# Altium schematic sheet POWER_DCDC_SOM.SchDoc: POWER DCDC SOM
size A3; Author: Silvio Navaretti; CompanyName: ARDUINO; DrawnBy: Silvio Navaretti; Engineer: Silvio Navaretti; Organization: ARDUINO; SheetNumber: 39; SheetTotal: 51; RevAuthor: Silvio Navaretti
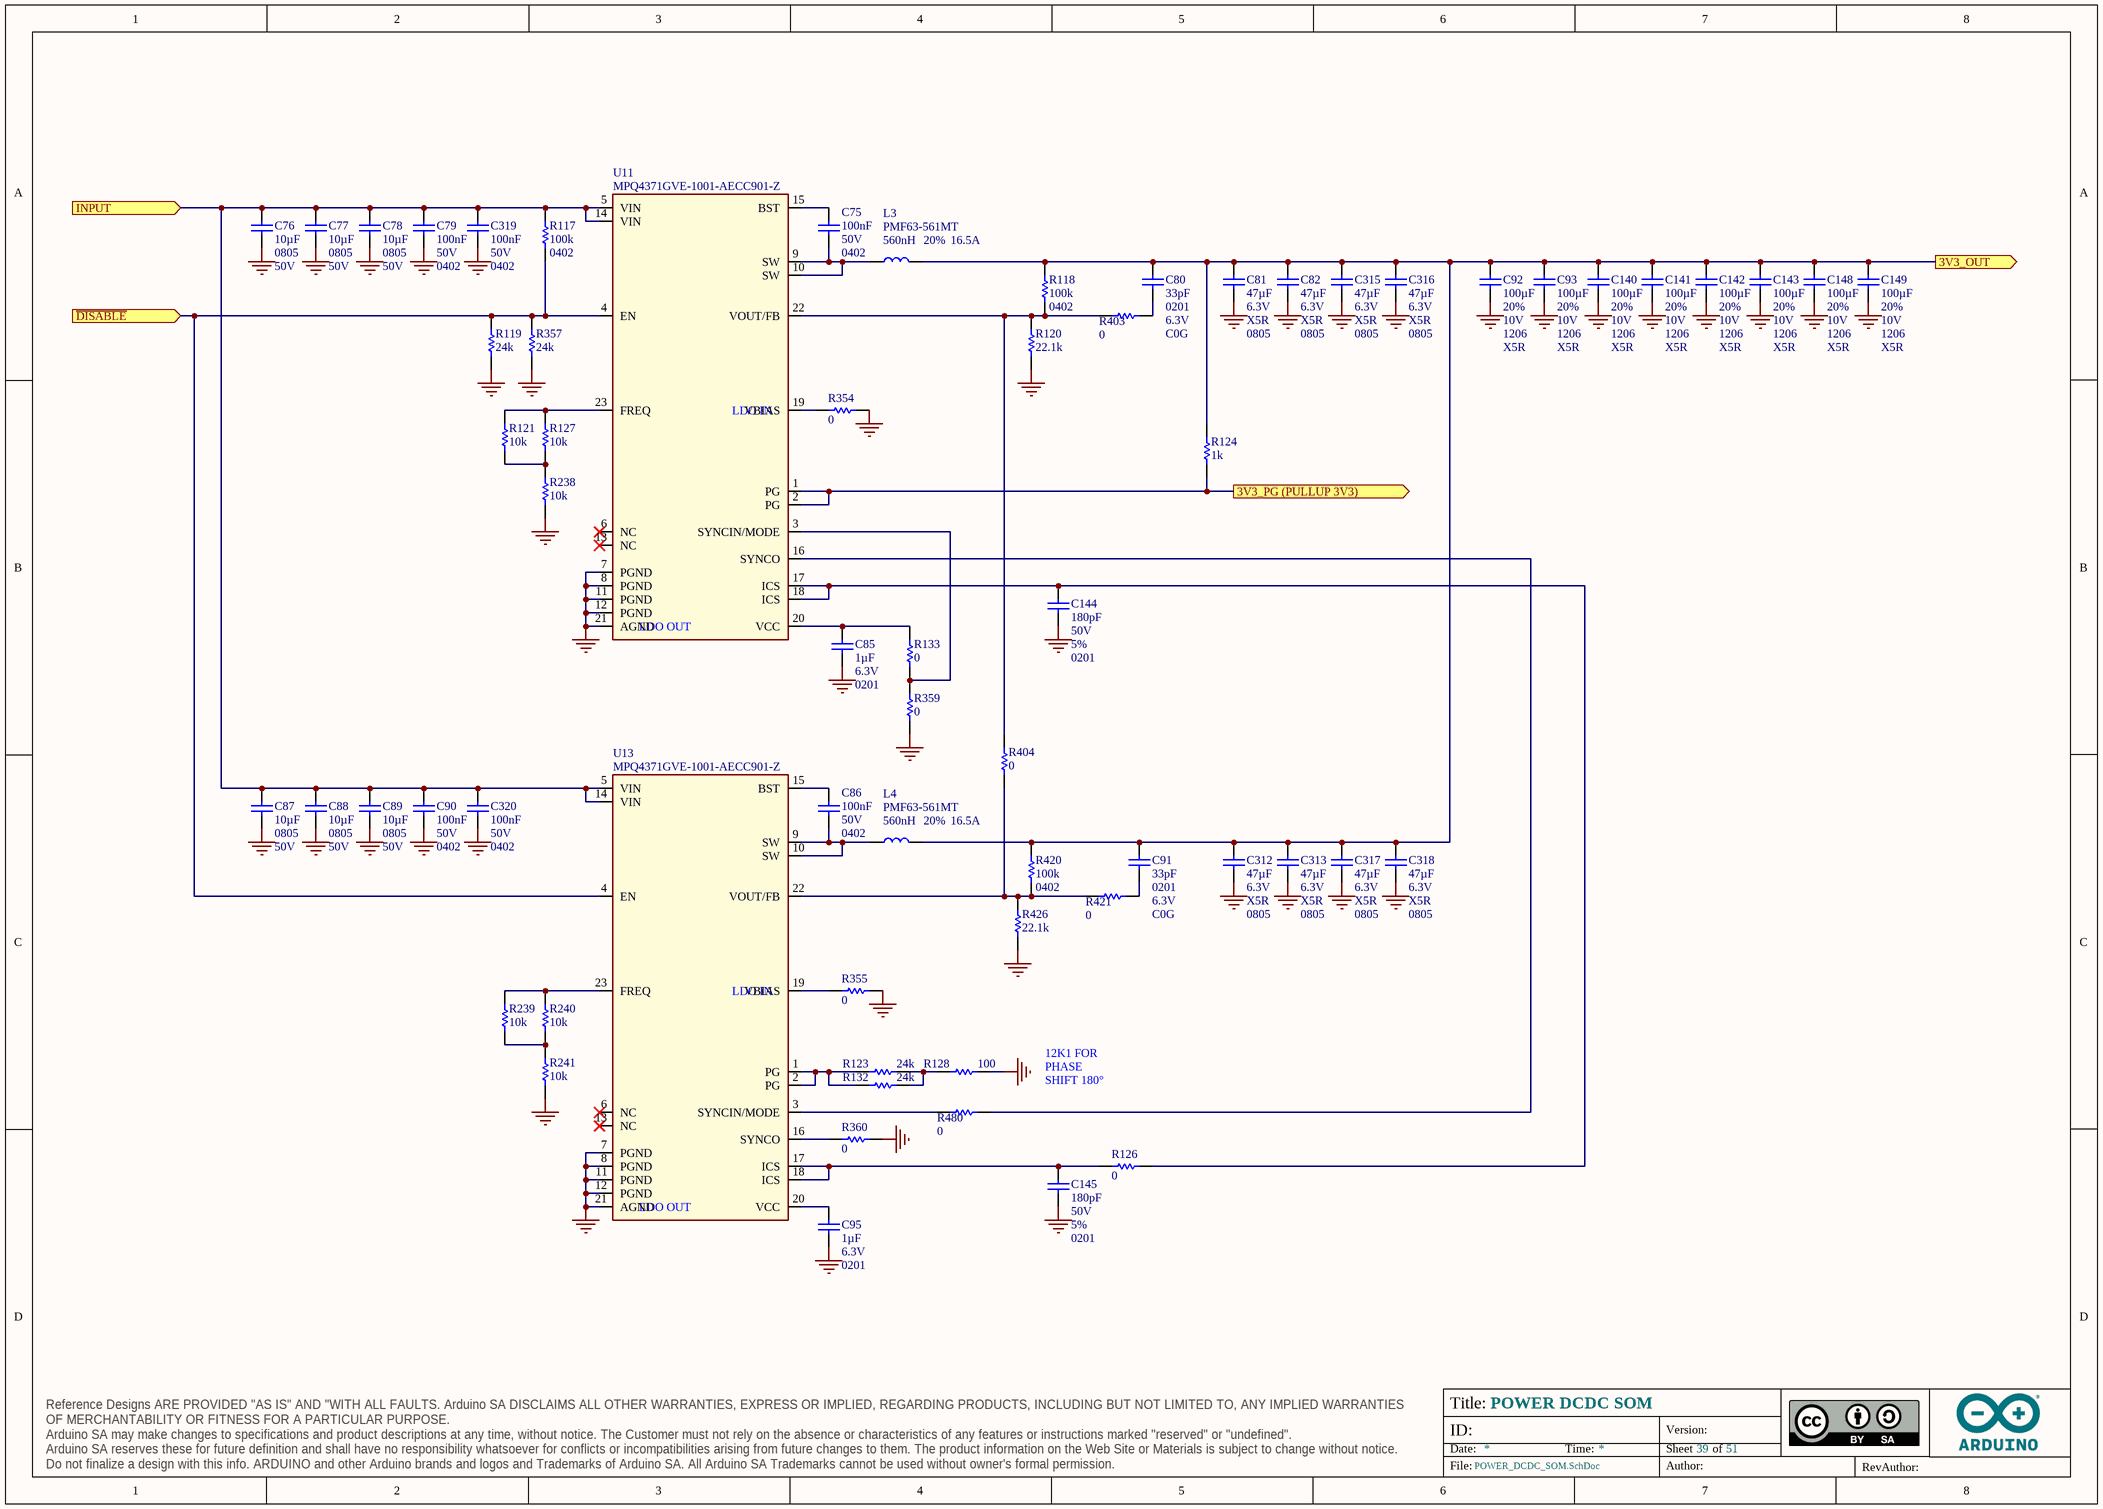
[diagram p0: POWER_DCDC_SOM.SchDoc]

## Parts
C75  value 100nF  Voltage: 50V  Case Code (Imperial): 0402  [CAP-0402]  (hidden comment: GRM155R61H104KE19D)
C76  value 10µF  Case Code (Imperial): 0805  Voltage: 50V  [CAP-0805]  (hidden comment: GRM21BR61H106ME43L)
C77  value 10µF  Case Code (Imperial): 0805  Voltage: 50V  [CAP-0805]  (hidden comment: GRM21BR61H106ME43L)
C78  value 10µF  Case Code (Imperial): 0805  Voltage: 50V  [CAP-0805]  (hidden comment: GRM21BR61H106ME43L)
C79  value 100nF  Voltage: 50V  Case Code (Imperial): 0402  [CAP-0402]  (hidden comment: GRM155R61H104KE19D)
C80  value 33pF  Case Code (Imperial): 0201  Voltage: 6.3V  Dielectric: C0G  [CAP-0201]  (hidden comment: GJM0335C0J330JB01J)
C81  value 47µF  Voltage: 6.3V  Dielectric: X5R  Case Code (Imperial): 0805  [CAP-0805]  (hidden comment: C0805C476M9PAC7800)
C82  value 47µF  Voltage: 6.3V  Dielectric: X5R  Case Code (Imperial): 0805  [CAP-0805]  (hidden comment: C0805C476M9PAC7800)
C85  value 1µF  Voltage: 6.3V  Case Code (Imperial): 0201  [CAP-0201]  (hidden comment: GRM033R60J105MEA2D)
C86  value 100nF  Voltage: 50V  Case Code (Imperial): 0402  [CAP-0402]  (hidden comment: GRM155R61H104KE19D)
C87  value 10µF  Case Code (Imperial): 0805  Voltage: 50V  [CAP-0805]  (hidden comment: GRM21BR61H106ME43L)
C88  value 10µF  Case Code (Imperial): 0805  Voltage: 50V  [CAP-0805]  (hidden comment: GRM21BR61H106ME43L)
C89  value 10µF  Case Code (Imperial): 0805  Voltage: 50V  [CAP-0805]  (hidden comment: GRM21BR61H106ME43L)
C90  value 100nF  Voltage: 50V  Case Code (Imperial): 0402  [CAP-0402]  (hidden comment: GRM155R61H104KE19D)
C91  value 33pF  Case Code (Imperial): 0201  Voltage: 6.3V  Dielectric: C0G  [CAP-0201]  (hidden comment: GJM0335C0J330JB01J)
C92  value 100µF  Tolerance: 20%  Voltage: 10V  Case Code (Imperial): 1206  Dielectric: X5R  [CAP-1206]  (hidden comment: GRM31CR61A107MEA8L)
C93  value 100µF  Tolerance: 20%  Voltage: 10V  Case Code (Imperial): 1206  Dielectric: X5R  [CAP-1206]  (hidden comment: GRM31CR61A107MEA8L)
C95  value 1µF  Voltage: 6.3V  Case Code (Imperial): 0201  [CAP-0201]  (hidden comment: GRM033R60J105MEA2D)
C140  value 100µF  Tolerance: 20%  Voltage: 10V  Case Code (Imperial): 1206  Dielectric: X5R  [CAP-1206]  (hidden comment: GRM31CR61A107MEA8L)
C141  value 100µF  Tolerance: 20%  Voltage: 10V  Case Code (Imperial): 1206  Dielectric: X5R  [CAP-1206]  (hidden comment: GRM31CR61A107MEA8L)
C142  value 100µF  Tolerance: 20%  Voltage: 10V  Case Code (Imperial): 1206  Dielectric: X5R  [CAP-1206]  (hidden comment: GRM31CR61A107MEA8L)
C143  value 100µF  Tolerance: 20%  Voltage: 10V  Case Code (Imperial): 1206  Dielectric: X5R  [CAP-1206]  (hidden comment: GRM31CR61A107MEA8L)
C144  value 180pF  Voltage: 50V  Tolerance: 5%  Case Code (Imperial): 0201  [CAP-0201]  (hidden comment: GRM0335C1H181JA01D)
C145  value 180pF  Voltage: 50V  Tolerance: 5%  Case Code (Imperial): 0201  [CAP-0201]  (hidden comment: GRM0335C1H181JA01D)
C148  value 100µF  Tolerance: 20%  Voltage: 10V  Case Code (Imperial): 1206  Dielectric: X5R  [CAP-1206]  (hidden comment: GRM31CR61A107MEA8L)
C149  value 100µF  Tolerance: 20%  Voltage: 10V  Case Code (Imperial): 1206  Dielectric: X5R  [CAP-1206]  (hidden comment: GRM31CR61A107MEA8L)
C312  value 47µF  Voltage: 6.3V  Dielectric: X5R  Case Code (Imperial): 0805  [CAP-0805]  (hidden comment: C0805C476M9PAC7800)
C313  value 47µF  Voltage: 6.3V  Dielectric: X5R  Case Code (Imperial): 0805  [CAP-0805]  (hidden comment: C0805C476M9PAC7800)
C315  value 47µF  Voltage: 6.3V  Dielectric: X5R  Case Code (Imperial): 0805  [CAP-0805]  (hidden comment: C0805C476M9PAC7800)
C316  value 47µF  Voltage: 6.3V  Dielectric: X5R  Case Code (Imperial): 0805  [CAP-0805]  (hidden comment: C0805C476M9PAC7800)
C317  value 47µF  Voltage: 6.3V  Dielectric: X5R  Case Code (Imperial): 0805  [CAP-0805]  (hidden comment: C0805C476M9PAC7800)
C318  value 47µF  Voltage: 6.3V  Dielectric: X5R  Case Code (Imperial): 0805  [CAP-0805]  (hidden comment: C0805C476M9PAC7800)
C319  value 100nF  Voltage: 50V  Case Code (Imperial): 0402  [CAP-0402]  (hidden comment: GRM155R61H104KE19D)
C320  value 100nF  Voltage: 50V  Case Code (Imperial): 0402  [CAP-0402]  (hidden comment: GRM155R61H104KE19D)
L3  PMF63-561MT  Inductance: 560nH  IRMS: 16.5A  Tolerance: 20%  [PMF63]
L4  PMF63-561MT  Inductance: 560nH  IRMS: 16.5A  Tolerance: 20%  [PMF63]
R117  value 100k  Case Code (Imperial): 0402  [RES-0402]  (hidden comment: CRCW0402100KFKEDC)
R118  value 100k  Case Code (Imperial): 0402  [RES-0402]  (hidden comment: CRCW0402100KFKEDC)
R119  value 24k  [RES-0201]  (hidden comment: RC0201FR-0724KL)
R120  value 22.1k  [RES-0201]  (hidden comment: RC0201FR-0722K1L)
R121  value 10k  [RES-0201]  (hidden comment: RC0201FR-0710KL)
R123  value 24k  [RES-0201]  (hidden comment: RC0201FR-0724KL)
R124  value 1k  [RES-0201]  (hidden comment: RC0201FR-071KL)
R126  value 0  [RES-0201]  (hidden comment: CRCW02010000Z0ED)
R127  value 10k  [RES-0201]  (hidden comment: RC0201FR-0710KL)
R128  value 100  [RES-0201]  (hidden comment: RC0201FR-07100RL)
R132  value 24k  [RES-0201]  (hidden comment: RC0201FR-0724KL)
R133  value 0  [RES-0201]  (hidden comment: CRCW02010000Z0ED)
R238  value 10k  [RES-0201]  (hidden comment: RC0201FR-0710KL)
R239  value 10k  [RES-0201]  (hidden comment: RC0201FR-0710KL)
R240  value 10k  [RES-0201]  (hidden comment: RC0201FR-0710KL)
R241  value 10k  [RES-0201]  (hidden comment: RC0201FR-0710KL)
R354  value 0  [RES-0201]  (hidden comment: CRCW02010000Z0ED)
R355  value 0  [RES-0201]  (hidden comment: CRCW02010000Z0ED)
R357  value 24k  [RES-0201]  (hidden comment: RC0201FR-0724KL)
R359  value 0  [RES-0201]  (hidden comment: CRCW02010000Z0ED)
R360  value 0  [RES-0201]  (hidden comment: CRCW02010000Z0ED)
R403  value 0  [RES-0201]  (hidden comment: CRCW02010000Z0ED)
R404  value 0  [RES-0201]  (hidden comment: CRCW02010000Z0ED)
R420  value 100k  Case Code (Imperial): 0402  [RES-0402]  (hidden comment: CRCW0402100KFKEDC)
R421  value 0  [RES-0201]  (hidden comment: CRCW02010000Z0ED)
R426  value 22.1k  [RES-0201]  (hidden comment: RC0201FR-0722K1L)
R480  value 0  [RES-0201]  (hidden comment: CRCW02010000Z0ED)
U11  MPQ4371GVE-1001-AECC901-Z  [MPQ4371GVE-1001-AECC901-Z]
U13  MPQ4371GVE-1001-AECC901-Z  [MPQ4371GVE-1001-AECC901-Z]

## Ports
3V3_OUT (out), 3V3_PG (PULLUP 3V3) (out), INPUT (in), ~{DISABLE} (in)

## Nets
GND: C76.2 C77.2 C78.2 C79.2 C81.1 C82.1 C85.1 C87.2 C88.2 C89.2 C90.2 C92.2 C93.2 C95.1 C140.2 C141.2 C142.2 C143.2 C144.1 C145.1 C148.2 C149.2 C312.1 C313.1 C315.1 C316.1 C317.1 C318.1 C319.2 C320.2 R119.1 R120.1 R128.2 R238.1 R241.1 R354.1 R355.1 R357.1 R359.1 R360.1 R426.1 U11.7(PGND) U11.8(PGND) U11.11(PGND) U11.12(PGND) U11.21(AGND) U13.7(PGND) U13.8(PGND) U13.11(PGND) U13.12(PGND) U13.21(AGND)
3V3_OUT: C80.2 C81.2 C82.2 C91.2 C92.1 C93.1 C140.1 C141.1 C142.1 C143.1 C148.1 C149.1 C312.2 C313.2 C315.2 C316.2 C317.2 C318.2 L3.2 L4.2 R118.1 R124.1 R420.1 ; port 3V3_OUT
3V3_PG (PULLUP 3V3): R124.2 U11.1(PG) U11.2(PG) ; port 3V3_PG (PULLUP 3V3)
~{DISABLE}: R117.2 R119.2 R357.2 U11.4(EN) U13.4(EN) ; port ~{DISABLE}
INPUT: C76.1 C77.1 C78.1 C79.1 C87.1 C88.1 C89.1 C90.1 C319.1 C320.1 R117.1 U11.5(VIN) U11.14(VIN) U13.5(VIN) U13.14(VIN) ; port INPUT
NetC75_1: C75.1 U11.15(BST)
NetC75_2: C75.2 L3.1 U11.9(SW) U11.10(SW)
NetC80_1: C80.1 R403.2
NetC85_2: C85.2 R133.2 U11.20(VCC)
NetC86_1: C86.1 U13.15(BST)
NetC86_2: C86.2 L4.1 U13.9(SW) U13.10(SW)
NetC91_1: C91.1 R421.2
NetC95_2: C95.2 U13.20(VCC)
NetC144_2: C144.2 R126.1 U11.17(ICS) U11.18(ICS)
NetC145_2: C145.2 R126.2 U13.17(ICS) U13.18(ICS)
NetR118_2: R118.2 R120.2 R403.1 R404.1 U11.22(VOUT/FB)
NetR121_1: R121.1 R127.1 R238.2
NetR121_2: R121.2 R127.2 U11.23(FREQ)
NetR123_1: R123.1 R128.1 R132.1
NetR123_2: R123.2 R132.2 U13.1(PG) U13.2(PG)
NetR133_1: R133.1 R359.2 U11.3(SYNCIN/MODE)
NetR239_1: R239.1 R240.1 R241.2
NetR239_2: R239.2 R240.2 U13.23(FREQ)
NetR354_2: R354.2 U11.19(VBIAS)
NetR355_2: R355.2 U13.19(VBIAS)
NetR360_2: R360.2 U13.16(SYNCO)
NetR404_2: R404.2 R420.2 R421.1 R426.2 U13.22(VOUT/FB)
NetR480_1: R480.1 U13.3(SYNCIN/MODE)
NetR480_2: R480.2 U11.16(SYNCO)

Not connected (* = marked no-connect by the designer): U11 6(NC)* 13(NC)*; U13 6(NC)* 13(NC)*

## Notes on the sheet
- 12K1 FOR PHASE SHIFT 180°
- Title:
- ID:
- Date:
- Time:
- Version:
- Sheet
- of
- RevAuthor:
- Reference Designs ARE PROVIDED "AS IS" AND "WITH ALL FAULTS. Arduino SA DISCLAIMS ALL OTHER WARRANTIES, EXPRESS OR IMPLIED, REGARDING PRODUCTS, INCLUDING BUT NOT LIMITED TO, ANY IMPLIED WARRANTIES OF MERCHANTABILITY OR FITNESS FOR A PARTICULAR PURPOSE.
  Arduino SA may make changes to specifications and product descriptions at any time, without notice. The Customer must not rely on the absence or characteristics of any features or instructions marked "reserved" or "undefined".
  Arduino SA reserves these for future definition and shall have no responsibility whatsoever for conflicts or incompatibilities arising from future changes to them. The product information on the Web Site or Materials is subject to change without notice.
  Do not finalize a design with this info. ARDUINO and other Arduino brands and logos and Trademarks of Arduino SA. All Arduino SA Trademarks cannot be used without owner's formal permission.
- File:
- Author:
- (in symbol U0503-A.7) LDO IN; LDO OUT

## Library data of the parts
C75 C79 C86 C90 C319 C320 = C0015-A.14: CAP CHIP 0402 100nF 10% 50V X5R; Manufacturer: Murata; Code Arduino: A5141; Part Number: GRM155R61H104KE19D; Dielectric: X5R; Tolerance: 10%; Technology: Ceramic
C76-C78 C87-C89 = C0158-A.3: CAP CHIP 0805 10uF 20% 50V X5R; Manufacturer: Murata Electronics; Code Arduino: C0158; Tolerance: 20%; Dielectric: X5R; Technology: SMD; Part Number: GRM21BR61H106ME43L
C80 C91 = C0114-A.6: CAP CHIP 0201 33pF 5% 6.3V C0G; Manufacturer: Murata Electronics; Code Arduino: C0114; Technology: Ceramic; Tolerance: 5%; Part Number: GJM0335C0J330JB01J
C81 C82 C312 C313 C315-C318 = C0199-A.1: CAP CHIP 0805 47uF 20% 6.3V X5R; Manufacturer: KEMET; Code Arduino: C0199; Technology: Ceramic; Tolerance: 20%; Part Number: C0805C476M9PAC7800
C85 C95 = C0002-A.15: CAP CHIP 0201 1uF 20% 6.3V X5R; Manufacturer: Murata; Code Arduino: A5520; Tolerance: 20%; Dielectric: X5R; Part Number: GRM033R60J105MEA2D; Technology: Ceramic
C92 C93 C140-C143 C148 C149 = C0166-A.1: CAP CHIP 1206 100uF 20% 10V X5R; Manufacturer: Murata; Code Arduino: C0166; Datasheet: https://www.mouser.it/datasheet/2/281/1/GRM31CR61A107MEA8_01A-1987899.pdf; Technology: Thick film; Part Number: GRM31CR61A107MEA8L
C144 C145 = C0198-A.1: CAP CHIP 0201 180pF 5% 50V C0G; Manufacturer: Murata; Code Arduino: C0198; Technology: Ceramic; Dielectric: C0G; Part Number: GRM0335C1H181JA01D
L3 L4 = I0124-A.1: IND 0.56uH 20%, max 5mR, IRMS 16.5A, Isat 25.5A, 7.3x6.6x3mm; Manufacturer: K-WELL; Code Arduino: I0124; DCR max: 5m; ISAT: 25.5A; Part Number: PMF63-561MT; Case Code (Metric): 7.3x6.6x3mm; Max Operating Temperature: 125°C; ComponentLink1URL: http://www.kw-magnetics.com/index.php?m=content&c=index&a=show&catid=162&id=294
R117 R118 R420 = R0001-A.24: RES CHIP 0402 100k 1% 1/16W; Manufacturer: Vishay; Power: 62.5mW; Code Arduino: 0134; Temperature coefficient: 100ppm; Tolerance: 1%; Part Number: CRCW0402100KFKEDC; Technology: Thick film
R119 R123 R132 R357 = R0398-A.1: RES CHIP 0201 24k 1% 1/20W; Manufacturer: YAGEO; Power: 50mW; Code Arduino: R0398; Temperature Coefficient: 200ppm; Technology: Thick film; Tolerance: 1%; Case Code (Imperial): 0201; Part Number: RC0201FR-0724KL
R120 R426 = R0396-A.1: RES CHIP 0201 22k1 1% 1/20W; Manufacturer: YAGEO; Code Arduino: R0396; Temperature Coefficient: 200ppm; Power: 50mW; Part Number: RC0201FR-0722K1L; Tolerance: 1%; Technology: Thick film; Case Code (Imperial): 0201
R121 R127 R238-R241 = R0145-A.21: RES CHIP 0201 10k 1% 1/20W; Manufacturer: Yageo; Power: 50mW; Temperature coefficient: 200ppm; Code Arduino: R0145; Manufacturer 2: Samsung Electro-Mechanics; Tolerance: 1%; Case Code (Imperial): 0201; Part Number: RC0201FR-0710KL; Technology: Thick film
R124 = R0195-A.22: RES CHIP 0201 1k 1% 1/20W; Manufacturer: Yageo; Power: 50mW; Temperature coefficient: 200ppm; Code Arduino: R0195; Tolerance: 1%; Case Code (Imperial): 0201; Part Number: RC0201FR-071KL; Technology: Thick film
R126 R133 R354 R355 R359 R360 R403 R404 R421 R480 = R0140-A.21: RES CHIP 0201 0R; Manufacturer: Vishay; Temperature coefficient: 0ppm; Code Arduino: R0140; Power: 50mW; Tolerance: 0%; Technology: Thick film; Case Code (Imperial): 0201; Part Number: CRCW02010000Z0ED
R128 = R0235-A.13: RES CHIP 0201 100R 1% 1/20W; Manufacturer: YAGEO; Power: 50mW; Temperature coefficient: 200ppm; Code Arduino: R0235; Tolerance: 1%; Case Code (Imperial): 0201; Technology: Thick film; Part Number: RC0201FR-07100RL
U11 U13 = U0503-A.7: IC Buck Vin 36V, Vout ADJ, Iout max 11A, with FSS, multi phase, QFN23 4x5mm; Manufacturer: MPS; Code Arduino: U0503; Part Number: MPQ4371GVE-1001-AECC901-Z